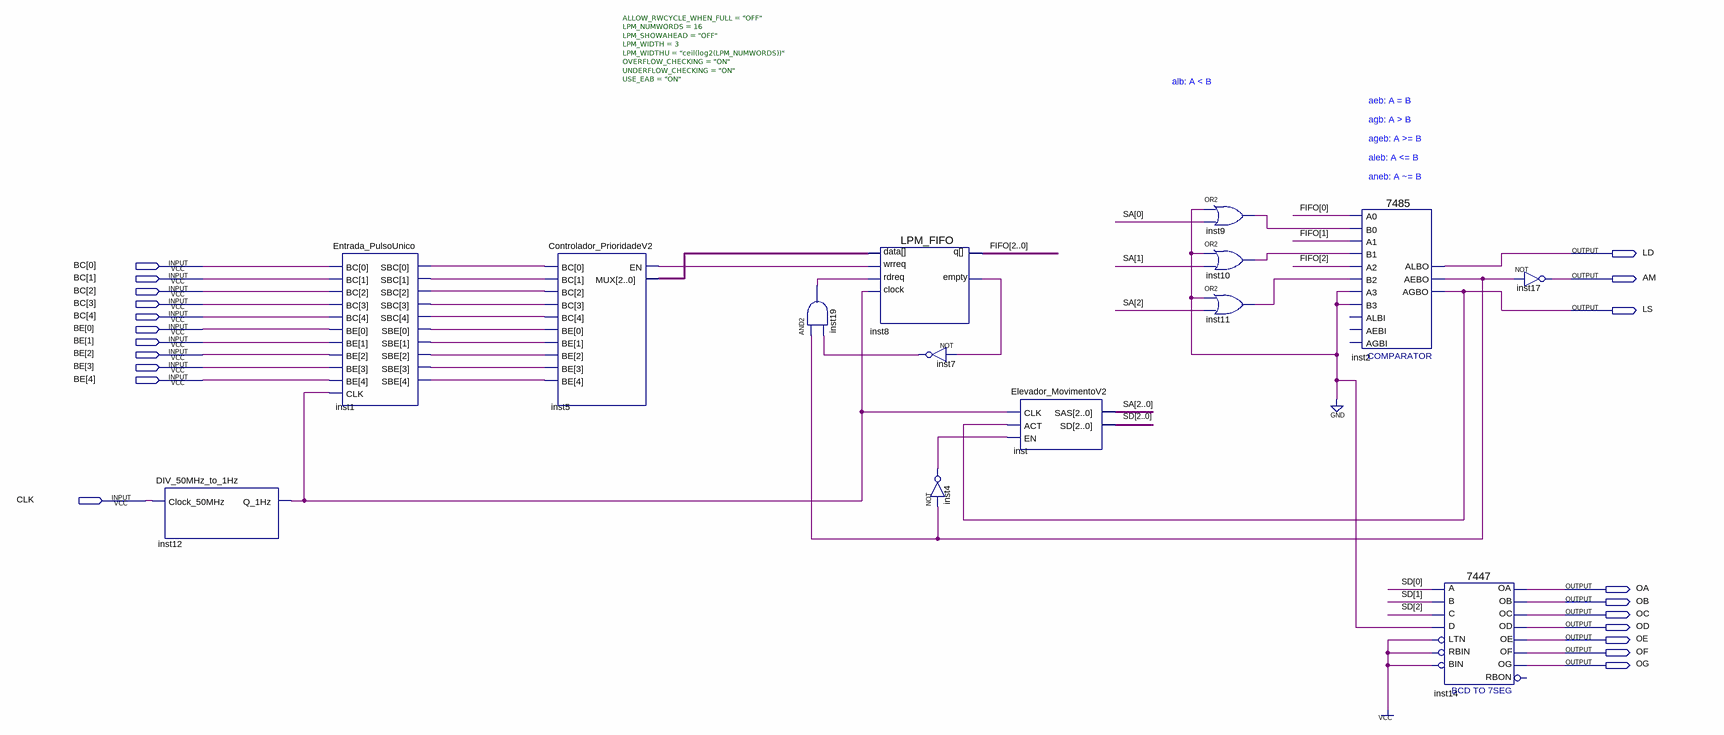
[diagram p0: schematic sheet]
// Quartus schematic Elevador_BetaV4.bdf as structural Verilog: 14 symbols, 21 pins
module Elevador_BetaV4 (
  input  [4:0] BC,
  input  [4:0] BE,
  input  CLK,
  output LD,
  output AM,
  output LS,
  output OA,
  output OB,
  output OC,
  output OD,
  output OE,
  output OF,
  output OG
);

  wire inst1_sbc, inst1_sbc_2, inst1_sbc_3, inst1_sbc_4, inst1_sbc_5, inst1_sbe, inst1_sbe_2, inst1_sbe_3,
       inst1_sbe_4, inst1_sbe_5, inst2_aebo, inst4_out, inst5_en, inst7_out, inst8_empty, inst9_out,
       inst10_out, inst11_out, inst12_q_1hz, inst19_out;
  wire [2:0] FIFO, inst5_mux, SA, SD;

  DIV_50MHz_to_1Hz inst12 (.Clock_50MHz(CLK), .Q_1Hz(inst12_q_1hz));
  Entrada_PulsoUnico inst1 (
    .BC(BC), .BE(BE), .CLK(inst12_q_1hz),
    .SBC({inst1_sbc_5, inst1_sbc_4, inst1_sbc_3, inst1_sbc_2, inst1_sbc}),
    .SBE({inst1_sbe_5, inst1_sbe_4, inst1_sbe_3, inst1_sbe_2, inst1_sbe}));
  Controlador_PrioridadeV2 inst5 (
    .BC({inst1_sbc_5, inst1_sbc_4, inst1_sbc_3, inst1_sbc_2, inst1_sbc}),
    .BE({inst1_sbe_5, inst1_sbe_4, inst1_sbe_3, inst1_sbe_2, inst1_sbe}), .EN(inst5_en), .MUX(inst5_mux));
  and inst19 (inst19_out, inst2_aebo, inst7_out);
  LPM_FIFO #(.ALLOW_RWCYCLE_WHEN_FULL("OFF"), .LPM_NUMWORDS(16), .LPM_SHOWAHEAD("OFF"), .LPM_WIDTH(3), .LPM_WIDTHU("ceil(log2(LPM_NUMWORDS))"), .OVERFLOW_CHECKING("ON"), .UNDERFLOW_CHECKING("ON"), .USE_EAB("ON")) inst8 (
    .clock(inst12_q_1hz), .data(inst5_mux), .rdreq(inst19_out), .wrreq(inst5_en), .empty(inst8_empty),
    .q(FIFO));
  not inst7 (inst7_out, inst8_empty);
  not inst4 (inst4_out, inst2_aebo);
  Elevador_MovimentoV2 inst (.CLK(inst12_q_1hz), .ACT(LS), .EN(inst4_out), .SAS(SA), .SD(SD));
  or inst9 (inst9_out, 1'b0, SA[0]);
  or inst10 (inst10_out, 1'b0, SA[1]);
  or inst11 (inst11_out, 1'b0, SA[2]);
  \7485  inst2 (
    .A3(1'b0), .B2(inst11_out), .A2(FIFO[2]), .A0(FIFO[0]), .B0(inst9_out), .B3(1'b0), .A1(FIFO[1]),
    .B1(inst10_out), .ALBO(LD), .AGBO(LS), .AEBO(inst2_aebo));  // open: AEBI, AGBI, ALBI
  \7447  inst14 (
    .LTN(1'b1), .B(SD[1]), .C(SD[2]), .D(1'b0), .RBIN(1'b1), .BIN(1'b1), .A(SD[0]), .OB(OB), .OC(OC),
    .OE(OE), .OD(OD), .OF(OF), .OG(OG), .OA(OA));  // open: RBON
  not inst17 (AM, inst2_aebo);

  // Notes on the sheet:
  //   alb: A < B
  //   aeb: A = B
  //   agb: A > B
  //   ageb: A >= B
  //   aleb: A <= B
  //   aneb: A ~= B
endmodule
